# Altium schematic sheet AD9156.SchDoc
size A4; SheetNumber: 7; SheetTotal: 7
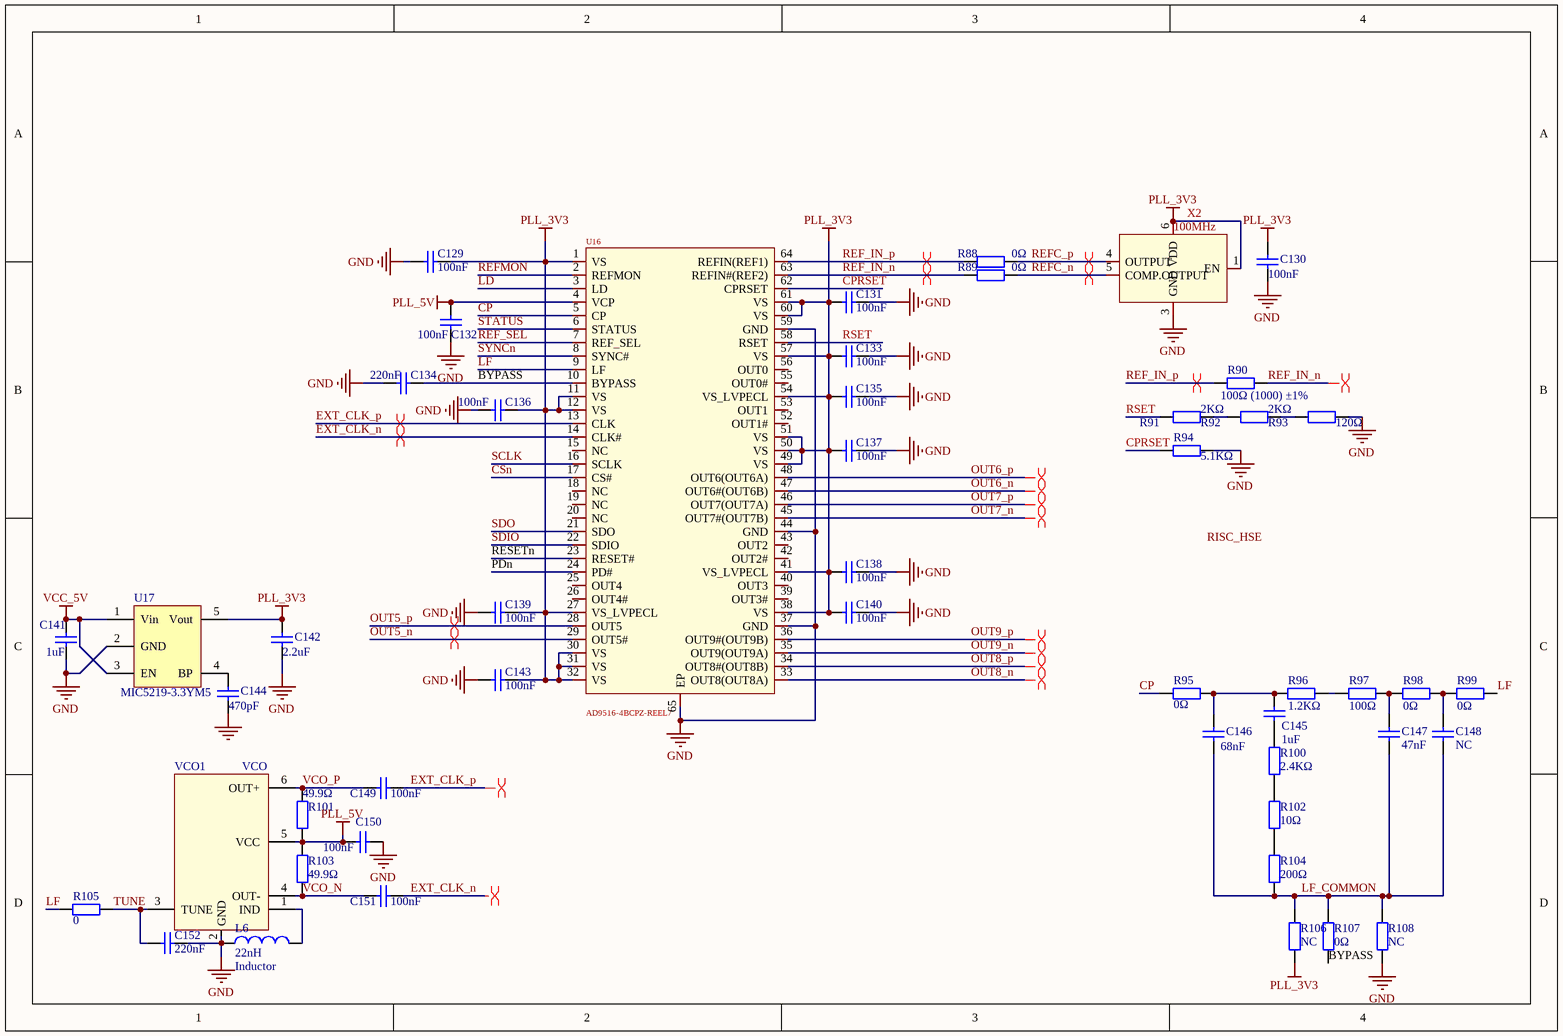
[diagram p0: AD9156.SchDoc]

## Parts
C129  100nF  [0201]
C130  100nF  [0201]
C131  100nF  [0201]
C132  100nF  [0201]
C133  100nF  [0201]
C134  220nF  [0805_C]
C135  100nF  [0201]
C136  100nF  [0201]
C137  100nF  [0201]
C138  100nF  [0201]
C139  100nF  [0201]
C140  100nF  [0201]
C141  1uF  [0805_C]
C142  2.2uF  [0805_C]
C143  100nF  [0201]
C144  470pF  [0805_C]
C145  1uF  [0805_C]
C146  68nF  [0805_C]
C147  47nF  [0805_C]
C148  NC  [0805_C]
C149  100nF  [0805_C]
C150  100nF  [0805_C]
C151  100nF  [0805_C]
C152  220nF  [0805_C]
L6  Inductor  value 22nH  [0805_L]
R88  0Ω  [0805_R]
R89  0Ω  [0805_R]
R90  100Ω (1000) ±1%  [0805_R]
R91  2KΩ  [0805_R]
R92  2KΩ  [0805_R]
R93  120Ω  [0805_R]
R94  5.1KΩ  [0805_R]
R95  0Ω  [0805_R]
R96  1.2KΩ  [0805_R]
R97  100Ω  [0805_R]
R98  0Ω  [0805_R]
R99  0Ω  [0805_R]
R100  2.4KΩ  [0805_R]
R101  49.9Ω  [0805_R]
R102  10Ω  [0805_R]
R103  49.9Ω  [0805_R]
R104  200Ω  [0805_R]
R105  0  [0805_R]
R106  NC  [0805_R]
R107  0Ω  [0805_R]
R108  NC  [0805_R]
U16  AD9516-4BCPZ-REEL7  [LFCSP-64_L9.0-W8.8-P0.50-TL-EP6.2]
U17  MIC5219-3.3YM5  [SOT-23-5]
VCO1  VCO  [SOT-23-6_L2.9-W1.6-P0.95-LS2.8-BL]
X2  100MHz  [OSC-SMD_6P-L3.2-W2.5-BL_SG3225EAN]

## Nets
GND: C129.1 C130.1 C131.2 C132.1 C133.2 C134.1 C135.1 C136.1 C137.2 C138.1 C139.1 C140.2 C141.1 C142.1 C143.1 C144.1 C150.1 C152.1 L6.1 R93.2 R94.2 R108.1 U16.37(GND) U16.44(GND) U16.59(GND) U16.65(EP) U17.2(GND) VCO1.2(GND) X2.3(GND)
PLL_3V3: C129.2 C130.2 C131.1 C133.1 C135.2 C136.2 C137.1 C138.2 C139.2 C140.1 C142.2 C143.2 R106.1 U16.1(VS) U16.11(VS) U16.12(VS) U16.27(VS_LVPECL) U16.30(VS) U16.31(VS) U16.32(VS) U16.38(VS) U16.41(VS_LVPECL) U16.49(VS) U16.50(VS) U16.51(VS) U16.54(VS_LVPECL) U16.57(VS) U16.60(VS) U16.61(VS) U17.5(Vout) X2.1(EN) X2.6(VDD)
PLL_5V: C132.2 C150.2 R101.1 R103.2 U16.4(VCP) VCO1.5(VCC)
VCC_5V: C141.2 U17.1(Vin) U17.3(EN)
BYPASS: C134.2 R107.1 U16.10(BYPASS)
CP: R95.1 U16.5(CP)
CPRSET: R94.1 U16.62(CPRSET)
CSn: U16.17(CS#)
EXT_CLK_n: C151.1 U16.14(CLK#)
EXT_CLK_p: C149.1 U16.13(CLK)
LD: U16.3(LD)
LF: R99.2 R105.2 U16.9(LF)
LF_COMMON: C146.1 C147.1 C148.1 R104.1 R106.2 R107.2 R108.2
OUT5_n: U16.29(OUT5#)
OUT5_p: U16.28(OUT5)
OUT6_n: U16.47(OUT6#(OUT6B))
OUT6_p: U16.48(OUT6(OUT6A))
OUT7_n: U16.45(OUT7#(OUT7B))
OUT7_p: U16.46(OUT7(OUT7A))
OUT8_n: U16.33(OUT8(OUT8A))
OUT8_p: U16.34(OUT8#(OUT8B))
OUT9_n: U16.35(OUT9(OUT9A))
OUT9_p: U16.36(OUT9#(OUT9B))
PDn: U16.24(PD#)
REF_IN_n: R89.1 R90.1 U16.63(REFIN#(REF2))
REF_IN_p: R88.1 R90.2 U16.64(REFIN(REF1))
REF_SEL: U16.7(REF_SEL)
REFC_n: R89.2 X2.5(COMP.OUTPUT)
REFC_p: R88.2 X2.4(OUTPUT)
REFMON: U16.2(REFMON)
RESETn: U16.23(RESET#)
RSET: R91.1 U16.58(RSET)
SCLK: U16.16(SCLK)
SDIO: U16.22(SDIO)
SDO: U16.21(SDO)
STATUS: U16.6(STATUS)
SYNCn: U16.8(SYNC#)
TUNE: C152.2 R105.1 VCO1.3(TUNE)
VCO_N: C151.2 R103.1 VCO1.4(OUT-)
VCO_P: C149.2 R101.2 VCO1.6(OUT+)
NetC144_2: C144.2 U17.4(BP)
NetC145_1: C145.1 R100.2
NetC145_2: C145.2 C146.2 R95.2 R96.1
NetC147_2: C147.2 R97.2 R98.1
NetC148_2: C148.2 R98.2 R99.1
NetL6_2: L6.2 VCO1.1(IND)
NetR91_2: R91.2 R92.1
NetR92_2: R92.2 R93.1
NetR96_2: R96.2 R97.1
NetR100_1: R100.1 R102.2
NetR102_1: R102.1 R104.2

Not connected (* = marked no-connect by the designer): U16 15(NC) 18(NC) 19(NC) 20(NC) 25(OUT4) 26(OUT4#) 39(OUT3#) 40(OUT3) 42(OUT2#) 43(OUT2) 52(OUT1#) 53(OUT1) 55(OUT0#) 56(OUT0)

## Layout directives
differential pair: EXT_CLK_n, EXT_CLK_p, OUT5_n, OUT5_p, OUT6_n, OUT6_p, OUT7_n, OUT7_p, OUT8_n, OUT8_p, OUT9_n, OUT9_p, REF_IN_n, REF_IN_p, REFC_n, REFC_p

## Notes on the sheet
- Labels drawn without touching a wire or pin: RISC_HSE

## Library data of the parts
C129-C133 C135-C140 C143 = 0402 100nF (104) 10% 16V: 贴片电容; ComponentLink1Description: 供应商链接; ComponentLink1URL: http://www.szlcsc.com/product/details_1877.html; Package: 0402; Supplier: LC; SuppliersPartNumber: C1525
C134 = 0402 220nF (224) 10% 16V: 贴片电容; ComponentLink1Description: 供应商链接; ComponentLink1URL: http://www.szlcsc.com/product/details_17456.html; Package: 0402; Supplier: LC; SuppliersPartNumber: C16772
C141 C142 C144 = 0805 1uF (105) 10% 50V: 贴片电容; ComponentLink1Description: 供应商链接; ComponentLink1URL: http://www.szlcsc.com/product/details_29074.html; Package: 0805; Supplier: LC; SuppliersPartNumber: C28323
C145 C147 C148 = 0805 47nF (473) 10% 50V: 贴片电容; ComponentLink1Description: 供应商链接; ComponentLink1URL: http://www.szlcsc.com/product/details_54150.html; Package: 0805; Supplier: LC; SuppliersPartNumber: C53134
C146 = 0603 68nF (683) 10% 50V: 贴片电容; ComponentLink1Description: 供应商链接; ComponentLink1URL: http://www.szlcsc.com/product/details_32617.html; Package: 0603; Supplier: LC; SuppliersPartNumber: C31658
C149-C152 = 0805 100nF(104) 10% 50V: 贴片电容; ComponentLink1Description: 供应商链接; ComponentLink1URL: http://www.szlcsc.com/product/details_50686.html; Package: 0805; Supplier: LC; SuppliersPartNumber: C49678
L6 = Inductor: Code_IEC: 1005; Published: 8-Jun-2000; LatestRevisionDate: 29-May-2009; LatestRevisionNote: IPC-7351 Footprint Added.; PackageReference: 0402-A; Publisher: Altium Limited; PackageDescription: Chip Inductor; Code_JEITA: 0402
R88 R89 = 0402 0Ω (0R0) 1%: 贴片电阻; ComponentLink1Description: 供应商链接; ComponentLink1URL: http://www.szlcsc.com/product/details_17853.html; Package: 0402; Supplier: LC; SuppliersPartNumber: C17168
R90 = 0402 100Ω (1000) 1%: 贴片电阻; ComponentLink1Description: 供应商链接; ComponentLink1URL: http://www.szlcsc.com/product/details_25819.html; Package: 0402; Supplier: LC; SuppliersPartNumber: C25076
R91 R92 = 0402 2KΩ (2001) 1%: 贴片电阻; ComponentLink1Description: 供应商链接; ComponentLink1URL: http://www.szlcsc.com/product/details_4516.html; Package: 0402; Supplier: LC; SuppliersPartNumber: C4109
R93 = 0402 120KΩ (1203) 1%: 贴片电阻; ComponentLink1Description: 供应商链接; ComponentLink1URL: http://www.szlcsc.com/product/details_26493.html; Package: 0402; Supplier: LC; SuppliersPartNumber: C25750
R94 = 0402 5.1KΩ (5101) 1%: 贴片电阻; ComponentLink1Description: 供应商链接; ComponentLink1URL: http://www.szlcsc.com/product/details_26648.html; Package: 0402; Supplier: LC; SuppliersPartNumber: C25905
R95-R100 R102 R104 R106-R108 = 0805 0Ω (0R0) 1%: 贴片电阻; ComponentLink1Description: 供应商链接; ComponentLink1URL: http://www.szlcsc.com/product/details_18165.html; Package: 0805; Supplier: LC; SuppliersPartNumber: C17477
R101 R103 R105 = 0805 49.9Ω (49R9) 1%: 贴片电阻; ComponentLink1Description: 供应商链接; ComponentLink1URL: http://www.szlcsc.com/product/details_18408.html; Package: 0805; Supplier: LC; SuppliersPartNumber: C17720
U16 = AD9516-4BCPZ-REEL7: 时钟分配芯片; Manufacturer: ADI(亚德诺); Add into BOM: yes; Output Frequency(Max): 2.4GHz; Voltage - Supply: 3.135V~3.465V; Number of Outputs: 10; Input Low Voltage: 800mV; Intput High Voltage: 2V; Symbol: AD9516-4BCPZ-REEL7; Device: AD9516-4BCPZ-REEL7; LCSC Part Name: 14-具有集成1.6 GHz VCO的输出时钟发生器; Supplier Part: C653502; Manufacturer Part: AD9516-4BCPZ-REEL7; Supplier Footprint: LFCSP-64(9x9); JLCPCB Part Class: Extended Part; Datasheet: https://atta.szlcsc.com/upload/public/pdf/source/20220408/79BD7CFE6E0B71D46ED75CF470DA5615.pdf; Supplier: LCSC; Convert to PCB: yes; Operating Temperature: -40℃~+85℃
U17 = RT9193-33: 3.3v低压差稳压芯片
VCO1 = MAX2608: 300MHz~500MHz VCO
X2 = SX3DF100.000B20F30PNN: 3225有源差分晶体; Manufacturer: SCTF(星通时频); Add into BOM: yes; Normal temperature Frequency Tolerance: ±20ppm; Output Type: LVPECL; Voltage - Supply: 3.3V; Current - Supply: 50mA; Symbol: SX3DF100.000B20F30PNN; Device: SX3DF100.000B20F30PNN; LCSC Part Name: 100MHz 3.3V ±20ppm LVPECL; Supplier Part: C5830670; Manufacturer Part: SX3DF100.000B20F30PNN; Supplier Footprint: SMD3225-6P; JLCPCB Part Class: Extended Part; Datasheet: https://item.szlcsc.com/datasheet/SX3DF100.000B20F30PNN/6761487.html; Supplier: LCSC; Convert to PCB: yes; Value: 100MHz; Frequency Stability: ±20ppm; Operating Temperature: -40℃~+85℃